# Altium project magic_baton.PrjPcb
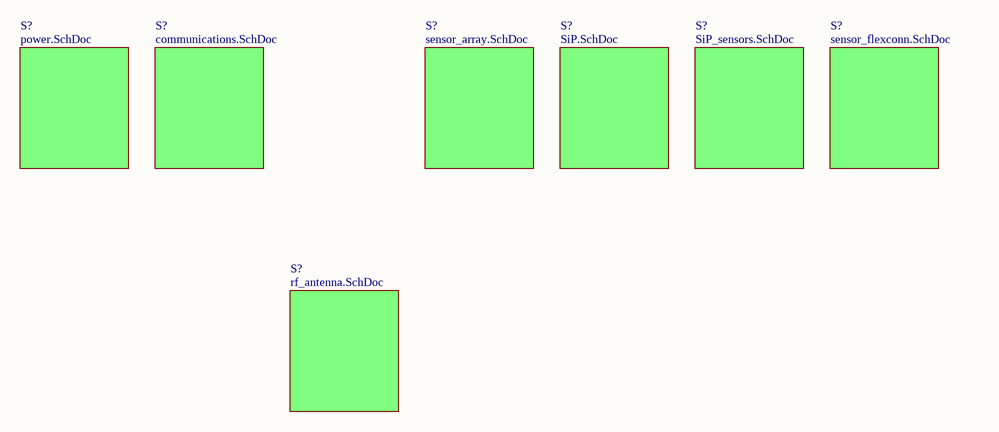
[diagram p0: magic_baton_top.SchDoc]
Revision: A
9 sheets, 174 parts. Net scope: hierarchical (ports join the sheet entries above them; power ports are global).
Sheets:
  magic_baton_top.SchDoc
    S? = power.SchDoc
    S? = communications.SchDoc
    S? = rf_antenna.SchDoc
    S? = sensor_array.SchDoc
      S1 = sensor_single.SchDoc
      S8 = sensor_single.SchDoc
      S7 = sensor_single.SchDoc
      S6 = sensor_single.SchDoc
      S5 = sensor_single.SchDoc
      S4 = sensor_single.SchDoc
      S3 = sensor_single.SchDoc
      S2 = sensor_single.SchDoc
      S9 = sensor_single.SchDoc
      S16 = sensor_single.SchDoc
      S15 = sensor_single.SchDoc
      S14 = sensor_single.SchDoc
      S13 = sensor_single.SchDoc
      S12 = sensor_single.SchDoc
      S11 = sensor_single.SchDoc
      S10 = sensor_single.SchDoc
      S17 = sensor_single.SchDoc
      S24 = sensor_single.SchDoc
      S23 = sensor_single.SchDoc
      S22 = sensor_single.SchDoc
      S21 = sensor_single.SchDoc
      S20 = sensor_single.SchDoc
      S19 = sensor_single.SchDoc
      S18 = sensor_single.SchDoc
      S25 = sensor_single.SchDoc
      S32 = sensor_single.SchDoc
      S31 = sensor_single.SchDoc
      S30 = sensor_single.SchDoc
      S29 = sensor_single.SchDoc
      S28 = sensor_single.SchDoc
      S27 = sensor_single.SchDoc
      S26 = sensor_single.SchDoc
    S? = SiP.SchDoc
    S? = SiP_sensors.SchDoc
    S? = sensor_flexconn.SchDoc

## Sheet magic_baton_top.SchDoc: Magic Baton: Top Sheet
size Letter; Organization: UBC ECE Capstone 2020S; Address1: Team 8; Address3: Magic Baton; Revision: A

### Sub-sheets
S? = power.SchDoc: no entries
S? = communications.SchDoc: no entries
S? = rf_antenna.SchDoc: no entries
S? = sensor_array.SchDoc: no entries
S? = SiP.SchDoc: no entries
S? = SiP_sensors.SchDoc: no entries
S? = sensor_flexconn.SchDoc: no entries

### Notes on the sheet
- Title
- Size:
- Date:
- Letter
- Number:
- Time:
- Revision:
- Sheet
- of
- File:

## Sheet power.SchDoc: Magic Baton: Power
size Letter
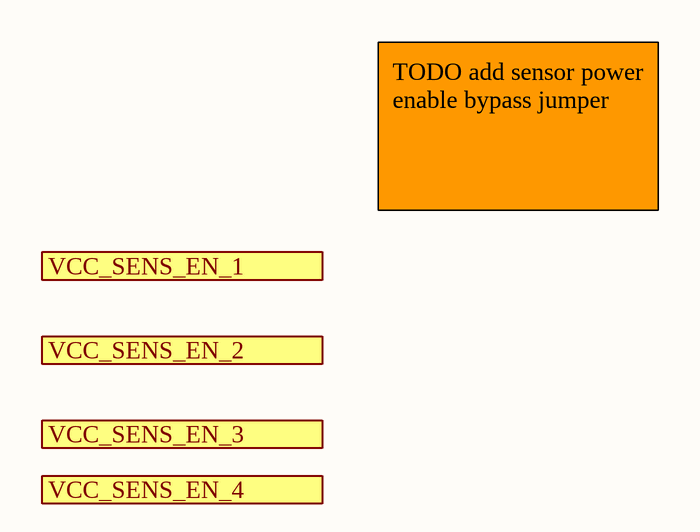
[diagram p1: power.SchDoc]

### Ports
VCC_SENS_EN_1 (in), VCC_SENS_EN_2 (in), VCC_SENS_EN_3 (in), VCC_SENS_EN_4 (in)

### Notes on the sheet
- TODO add sensor power enable bypass jumper
- Title
- Size:
- Date:
- Letter
- Number:
- Time:
- Revision:
- Sheet
- of
- File:

## Sheet communications.SchDoc: Magic Baton: Communications
size Letter

### Notes on the sheet
- Title
- Size:
- Date:
- Letter
- Number:
- Time:
- Revision:
- Sheet
- of
- File:

## Sheet rf_antenna.SchDoc: Magic Baton: RF
size Letter
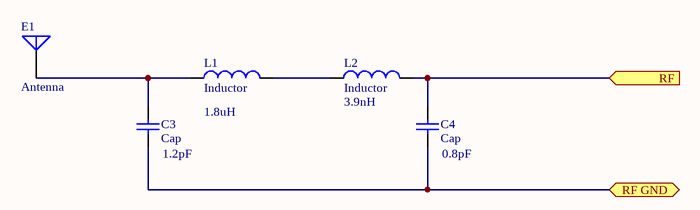
[diagram p2: rf_antenna.SchDoc]

### Parts
C3  Cap  value 1.2pF  [RAD-0.3]
C4  Cap  value 0.8pF  [RAD-0.3]
E1  Antenna  [PIN1]
L1  Inductor  value 1.8uH  [0402-A]
L2  Inductor  value 3.9nH  [0402-A]

### Ports
RF (in), RF GND (bidir)

### Nets
NetC3_1: C3.1 E1.1(A) L1.1
NetC3_2: C3.2 C4.2 ; port RF GND
NetC4_1: C4.1 L2.2 ; port RF
NetL1_2: L1.2 L2.1

### Notes on the sheet
- Title
- Size:
- Date:
- Letter
- Number:
- Time:
- Revision:
- Sheet
- of
- File:

### Library data of the parts
C3 C4 = Cap: Capacitor; Published: 8-Jun-2000; LatestRevisionDate: 17-Jul-2002; LatestRevisionNote: Re-released for DXP Platform.; PackageReference: RAD-0.3; Publisher: Altium Limited; PackageDescription: Radial Cap, Thru-Hole; 2 Leads; 0.3 in Pin Spacing
E1 = Antenna: Generic Antenna; Published: 24-Mar-1999; LatestRevisionDate: 17-Jul-2002; LatestRevisionNote: Re-released for DXP Platform.; PackageReference: PIN1; Publisher: Altium Limited
L1 L2 = Inductor: Code_IEC: 1005; Published: 8-Jun-2000; LatestRevisionDate: 29-May-2009; LatestRevisionNote: IPC-7351 Footprint Added.; PackageReference: 0402-A; Publisher: Altium Limited; PackageDescription: Chip Inductor; Code_JEITA: 0402

## Sheet sensor_array.SchDoc: Magic Baton: Sensor Array
size Letter
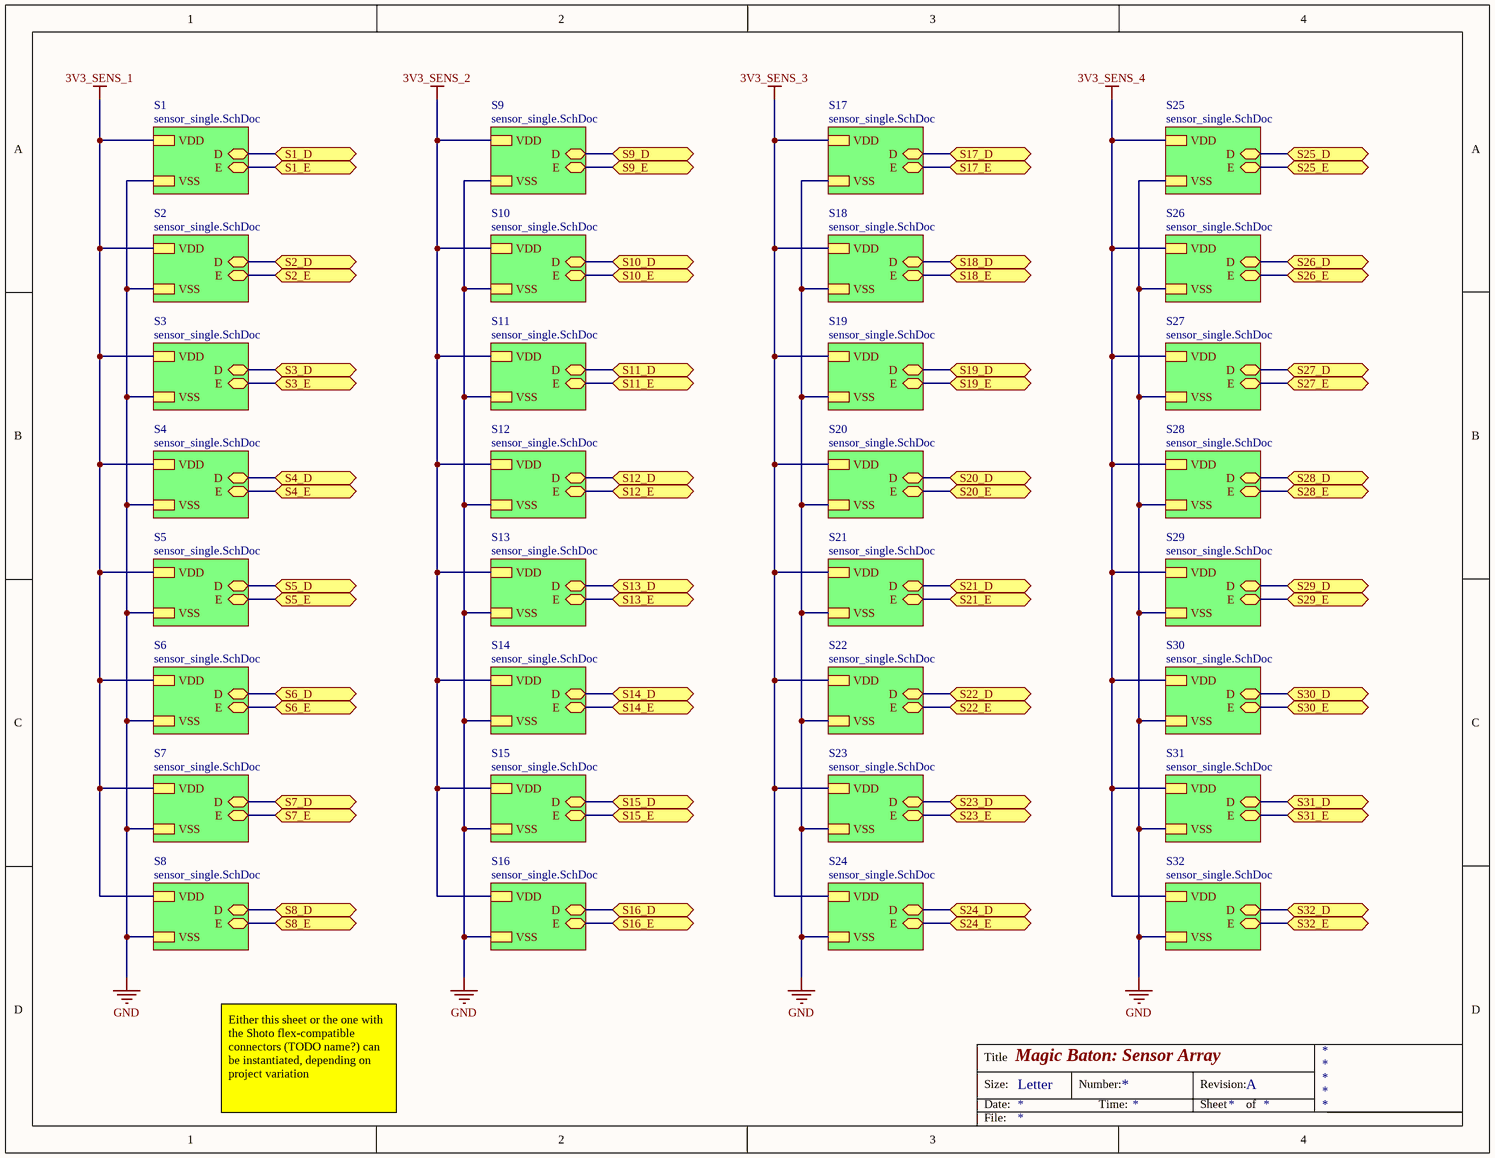
[diagram p3: sensor_array.SchDoc]

### Sub-sheets
S1 = sensor_single.SchDoc: D (bidir), E (bidir), VDD, VSS
S2 = sensor_single.SchDoc: D (bidir), E (bidir), VDD, VSS
S3 = sensor_single.SchDoc: D (bidir), E (bidir), VDD, VSS
S4 = sensor_single.SchDoc: D (bidir), E (bidir), VDD, VSS
S5 = sensor_single.SchDoc: D (bidir), E (bidir), VDD, VSS
S6 = sensor_single.SchDoc: D (bidir), E (bidir), VDD, VSS
S7 = sensor_single.SchDoc: D (bidir), E (bidir), VDD, VSS
S8 = sensor_single.SchDoc: D (bidir), E (bidir), VDD, VSS
S9 = sensor_single.SchDoc: D (bidir), E (bidir), VDD, VSS
S10 = sensor_single.SchDoc: D (bidir), E (bidir), VDD, VSS
S11 = sensor_single.SchDoc: D (bidir), E (bidir), VDD, VSS
S12 = sensor_single.SchDoc: D (bidir), E (bidir), VDD, VSS
S13 = sensor_single.SchDoc: D (bidir), E (bidir), VDD, VSS
S14 = sensor_single.SchDoc: D (bidir), E (bidir), VDD, VSS
S15 = sensor_single.SchDoc: D (bidir), E (bidir), VDD, VSS
S16 = sensor_single.SchDoc: D (bidir), E (bidir), VDD, VSS
S17 = sensor_single.SchDoc: D (bidir), E (bidir), VDD, VSS
S18 = sensor_single.SchDoc: D (bidir), E (bidir), VDD, VSS
S19 = sensor_single.SchDoc: D (bidir), E (bidir), VDD, VSS
S20 = sensor_single.SchDoc: D (bidir), E (bidir), VDD, VSS
S21 = sensor_single.SchDoc: D (bidir), E (bidir), VDD, VSS
S22 = sensor_single.SchDoc: D (bidir), E (bidir), VDD, VSS
S23 = sensor_single.SchDoc: D (bidir), E (bidir), VDD, VSS
S24 = sensor_single.SchDoc: D (bidir), E (bidir), VDD, VSS
S25 = sensor_single.SchDoc: D (bidir), E (bidir), VDD, VSS
S26 = sensor_single.SchDoc: D (bidir), E (bidir), VDD, VSS
S27 = sensor_single.SchDoc: D (bidir), E (bidir), VDD, VSS
S28 = sensor_single.SchDoc: D (bidir), E (bidir), VDD, VSS
S29 = sensor_single.SchDoc: D (bidir), E (bidir), VDD, VSS
S30 = sensor_single.SchDoc: D (bidir), E (bidir), VDD, VSS
S31 = sensor_single.SchDoc: D (bidir), E (bidir), VDD, VSS
S32 = sensor_single.SchDoc: D (bidir), E (bidir), VDD, VSS

### Ports
S1_D (bidir), S1_E (bidir), S2_D (bidir), S2_E (bidir), S3_D (bidir), S3_E (bidir), S4_D (bidir), S4_E (bidir), S5_D (bidir), S5_E (bidir), S6_D (bidir), S6_E (bidir), S7_D (bidir), S7_E (bidir), S8_D (bidir), S8_E (bidir), S9_D (bidir), S9_E (bidir), S10_D (bidir), S10_E (bidir), S11_D (bidir), S11_E (bidir), S12_D (bidir), S12_E (bidir), S13_D (bidir), S13_E (bidir), S14_D (bidir), S14_E (bidir), S15_D (bidir), S15_E (bidir), S16_D (bidir), S16_E (bidir), S17_D (bidir), S17_E (bidir), S18_D (bidir), S18_E (bidir), S19_D (bidir), S19_E (bidir), S20_D (bidir), S20_E (bidir), S21_D (bidir), S21_E (bidir), S22_D (bidir), S22_E (bidir), S23_D (bidir), S23_E (bidir), S24_D (bidir), S24_E (bidir), S25_D (bidir), S25_E (bidir), S26_D (bidir), S26_E (bidir), S27_D (bidir), S27_E (bidir), S28_D (bidir), S28_E (bidir), S29_D (bidir), S29_E (bidir), S30_D (bidir), S30_E (bidir), S31_D (bidir), S31_E (bidir), S32_D (bidir), S32_E (bidir)

### Nets
3V3_SENS_1: sheet S1/VDD, sheet S8/VDD, sheet S7/VDD, sheet S6/VDD, sheet S5/VDD, sheet S4/VDD, sheet S3/VDD, sheet S2/VDD
3V3_SENS_2: sheet S9/VDD, sheet S16/VDD, sheet S15/VDD, sheet S14/VDD, sheet S13/VDD, sheet S12/VDD, sheet S11/VDD, sheet S10/VDD
3V3_SENS_3: sheet S17/VDD, sheet S24/VDD, sheet S23/VDD, sheet S22/VDD, sheet S21/VDD, sheet S20/VDD, sheet S19/VDD, sheet S18/VDD
3V3_SENS_4: sheet S25/VDD, sheet S32/VDD, sheet S31/VDD, sheet S30/VDD, sheet S29/VDD, sheet S28/VDD, sheet S27/VDD, sheet S26/VDD
GND: sheet S1/VSS, sheet S8/VSS, sheet S7/VSS, sheet S6/VSS, sheet S5/VSS, sheet S4/VSS, sheet S3/VSS, sheet S2/VSS, sheet S9/VSS, sheet S16/VSS, sheet S15/VSS, sheet S14/VSS, sheet S13/VSS, sheet S12/VSS, sheet S11/VSS, sheet S10/VSS, sheet S17/VSS, sheet S24/VSS, sheet S23/VSS, sheet S22/VSS, sheet S21/VSS, sheet S20/VSS, sheet S19/VSS, sheet S18/VSS, sheet S25/VSS, sheet S32/VSS, sheet S31/VSS, sheet S30/VSS, sheet S29/VSS, sheet S28/VSS, sheet S27/VSS, sheet S26/VSS
NetU2_S1_C1: port S1_D, sheet S1/D
NetU2_S1_C2: port S1_E, sheet S1/E
NetU2_S2_C1: port S2_D, sheet S2/D
NetU2_S2_C2: port S2_E, sheet S2/E
NetU2_S3_C1: port S3_D, sheet S3/D
NetU2_S3_C2: port S3_E, sheet S3/E
NetU2_S4_C1: port S4_D, sheet S4/D
NetU2_S4_C2: port S4_E, sheet S4/E
NetU2_S5_C1: port S5_D, sheet S5/D
NetU2_S5_C2: port S5_E, sheet S5/E
NetU2_S6_C1: port S6_D, sheet S6/D
NetU2_S6_C2: port S6_E, sheet S6/E
NetU2_S7_C1: port S7_D, sheet S7/D
NetU2_S7_C2: port S7_E, sheet S7/E
NetU2_S8_C1: port S8_D, sheet S8/D
NetU2_S8_C2: port S8_E, sheet S8/E
NetU2_S9_C1: port S9_D, sheet S9/D
NetU2_S9_C2: port S9_E, sheet S9/E
NetU2_S10_C1: port S10_D, sheet S10/D
NetU2_S10_C2: port S10_E, sheet S10/E
NetU2_S11_C1: port S11_D, sheet S11/D
NetU2_S11_C2: port S11_E, sheet S11/E
NetU2_S12_C1: port S12_D, sheet S12/D
NetU2_S12_C2: port S12_E, sheet S12/E
NetU2_S13_C1: port S13_D, sheet S13/D
NetU2_S13_C2: port S13_E, sheet S13/E
NetU2_S14_C1: port S14_D, sheet S14/D
NetU2_S14_C2: port S14_E, sheet S14/E
NetU2_S15_C1: port S15_D, sheet S15/D
NetU2_S15_C2: port S15_E, sheet S15/E
NetU2_S16_C1: port S16_D, sheet S16/D
NetU2_S16_C2: port S16_E, sheet S16/E
NetU2_S17_C1: port S17_D, sheet S17/D
NetU2_S17_C2: port S17_E, sheet S17/E
NetU2_S18_C1: port S18_D, sheet S18/D
NetU2_S18_C2: port S18_E, sheet S18/E
NetU2_S19_C1: port S19_D, sheet S19/D
NetU2_S19_C2: port S19_E, sheet S19/E
NetU2_S20_C1: port S20_D, sheet S20/D
NetU2_S20_C2: port S20_E, sheet S20/E
NetU2_S21_C1: port S21_D, sheet S21/D
NetU2_S21_C2: port S21_E, sheet S21/E
NetU2_S22_C1: port S22_D, sheet S22/D
NetU2_S22_C2: port S22_E, sheet S22/E
NetU2_S23_C1: port S23_D, sheet S23/D
NetU2_S23_C2: port S23_E, sheet S23/E
NetU2_S24_C1: port S24_D, sheet S24/D
NetU2_S24_C2: port S24_E, sheet S24/E
NetU2_S25_C1: port S25_D, sheet S25/D
NetU2_S25_C2: port S25_E, sheet S25/E
NetU2_S26_C1: port S26_D, sheet S26/D
NetU2_S26_C2: port S26_E, sheet S26/E
NetU2_S27_C1: port S27_D, sheet S27/D
NetU2_S27_C2: port S27_E, sheet S27/E
NetU2_S28_C1: port S28_D, sheet S28/D
NetU2_S28_C2: port S28_E, sheet S28/E
NetU2_S29_C1: port S29_D, sheet S29/D
NetU2_S29_C2: port S29_E, sheet S29/E
NetU2_S30_C1: port S30_D, sheet S30/D
NetU2_S30_C2: port S30_E, sheet S30/E
NetU2_S31_C1: port S31_D, sheet S31/D
NetU2_S31_C2: port S31_E, sheet S31/E
NetU2_S32_C1: port S32_D, sheet S32/D
NetU2_S32_C2: port S32_E, sheet S32/E

### Notes on the sheet
- Either this sheet or the one with the Shoto flex-compatible connectors (TODO name?) can be instantiated, depending on project variation
- Title
- Size:
- Date:
- Letter
- Number:
- Time:
- Revision:
- Sheet
- of
- File:

## Sheet sensor_single.SchDoc: Magic Baton: Single Sensor
size Letter
Used 32 times, as channels S?/S1, S?/S8, S?/S7, S?/S6, S?/S5, S?/S4, S?/S3, S?/S2, S?/S9, S?/S16, S?/S15, S?/S14, S?/S13, S?/S12, S?/S11, S?/S10, S?/S17, S?/S24, S?/S23, S?/S22, S?/S21, S?/S20, S?/S19, S?/S18, S?/S25, S?/S32, S?/S31, S?/S30, S?/S29, S?/S28, S?/S27, S?/S26. Parts and nets are listed once, with the designators drawn on the sheet.
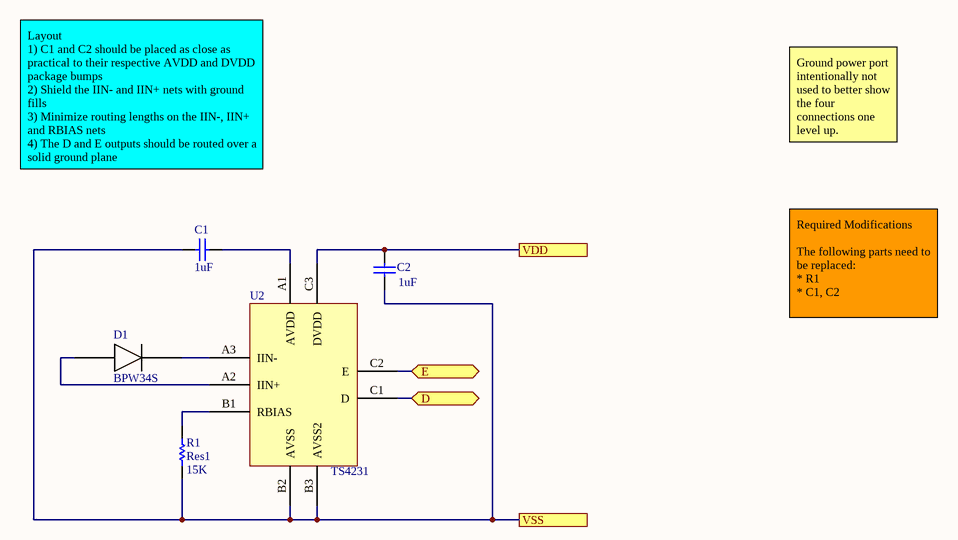
[diagram p4: sensor_single.SchDoc]

### Parts
C1  value 1uF  [RAD-0.3]  (hidden comment: Cap)
C2  value 1uF  [RAD-0.3]  (hidden comment: Cap)
D1  BPW34S
R1  Res1  value 15K  [AXIAL-0.3]
U2  TS4231

### Ports
D (bidir), E (bidir), VDD, VSS

### Nets
D: U2.C1(D) ; port D
E: U2.C2(E) ; port E
VDD: C2.1 U2.C3(DVDD) ; port VDD
VSS: C1.1 C2.2 R1.1 U2.B2(AVSS) U2.B3(AVSS2) ; port VSS
NetC1_2: C1.2 U2.A1(AVDD)
NetD1_A: D1.A U2.A2(IIN+)
NetD1_K: D1.K U2.A3(IIN-)
NetR1_2: R1.2 U2.B1(RBIAS)

### Channels
S?/S1: designators end in _S1; ports D=NetU2_S1_C1 E=NetU2_S1_C2 VDD=3V3_SENS_1 VSS=GND
S?/S8: designators end in _S8; ports D=NetU2_S8_C1 E=NetU2_S8_C2 VDD=3V3_SENS_1 VSS=GND
S?/S7: designators end in _S7; ports D=NetU2_S7_C1 E=NetU2_S7_C2 VDD=3V3_SENS_1 VSS=GND
S?/S6: designators end in _S6; ports D=NetU2_S6_C1 E=NetU2_S6_C2 VDD=3V3_SENS_1 VSS=GND
S?/S5: designators end in _S5; ports D=NetU2_S5_C1 E=NetU2_S5_C2 VDD=3V3_SENS_1 VSS=GND
S?/S4: designators end in _S4; ports D=NetU2_S4_C1 E=NetU2_S4_C2 VDD=3V3_SENS_1 VSS=GND
S?/S3: designators end in _S3; ports D=NetU2_S3_C1 E=NetU2_S3_C2 VDD=3V3_SENS_1 VSS=GND
S?/S2: designators end in _S2; ports D=NetU2_S2_C1 E=NetU2_S2_C2 VDD=3V3_SENS_1 VSS=GND
S?/S9: designators end in _S9; ports D=NetU2_S9_C1 E=NetU2_S9_C2 VDD=3V3_SENS_2 VSS=GND
S?/S16: designators end in _S16; ports D=NetU2_S16_C1 E=NetU2_S16_C2 VDD=3V3_SENS_2 VSS=GND
S?/S15: designators end in _S15; ports D=NetU2_S15_C1 E=NetU2_S15_C2 VDD=3V3_SENS_2 VSS=GND
S?/S14: designators end in _S14; ports D=NetU2_S14_C1 E=NetU2_S14_C2 VDD=3V3_SENS_2 VSS=GND
S?/S13: designators end in _S13; ports D=NetU2_S13_C1 E=NetU2_S13_C2 VDD=3V3_SENS_2 VSS=GND
S?/S12: designators end in _S12; ports D=NetU2_S12_C1 E=NetU2_S12_C2 VDD=3V3_SENS_2 VSS=GND
S?/S11: designators end in _S11; ports D=NetU2_S11_C1 E=NetU2_S11_C2 VDD=3V3_SENS_2 VSS=GND
S?/S10: designators end in _S10; ports D=NetU2_S10_C1 E=NetU2_S10_C2 VDD=3V3_SENS_2 VSS=GND
S?/S17: designators end in _S17; ports D=NetU2_S17_C1 E=NetU2_S17_C2 VDD=3V3_SENS_3 VSS=GND
S?/S24: designators end in _S24; ports D=NetU2_S24_C1 E=NetU2_S24_C2 VDD=3V3_SENS_3 VSS=GND
S?/S23: designators end in _S23; ports D=NetU2_S23_C1 E=NetU2_S23_C2 VDD=3V3_SENS_3 VSS=GND
S?/S22: designators end in _S22; ports D=NetU2_S22_C1 E=NetU2_S22_C2 VDD=3V3_SENS_3 VSS=GND
S?/S21: designators end in _S21; ports D=NetU2_S21_C1 E=NetU2_S21_C2 VDD=3V3_SENS_3 VSS=GND
S?/S20: designators end in _S20; ports D=NetU2_S20_C1 E=NetU2_S20_C2 VDD=3V3_SENS_3 VSS=GND
S?/S19: designators end in _S19; ports D=NetU2_S19_C1 E=NetU2_S19_C2 VDD=3V3_SENS_3 VSS=GND
S?/S18: designators end in _S18; ports D=NetU2_S18_C1 E=NetU2_S18_C2 VDD=3V3_SENS_3 VSS=GND
S?/S25: designators end in _S25; ports D=NetU2_S25_C1 E=NetU2_S25_C2 VDD=3V3_SENS_4 VSS=GND
S?/S32: designators end in _S32; ports D=NetU2_S32_C1 E=NetU2_S32_C2 VDD=3V3_SENS_4 VSS=GND
S?/S31: designators end in _S31; ports D=NetU2_S31_C1 E=NetU2_S31_C2 VDD=3V3_SENS_4 VSS=GND
S?/S30: designators end in _S30; ports D=NetU2_S30_C1 E=NetU2_S30_C2 VDD=3V3_SENS_4 VSS=GND
S?/S29: designators end in _S29; ports D=NetU2_S29_C1 E=NetU2_S29_C2 VDD=3V3_SENS_4 VSS=GND
S?/S28: designators end in _S28; ports D=NetU2_S28_C1 E=NetU2_S28_C2 VDD=3V3_SENS_4 VSS=GND
S?/S27: designators end in _S27; ports D=NetU2_S27_C1 E=NetU2_S27_C2 VDD=3V3_SENS_4 VSS=GND
S?/S26: designators end in _S26; ports D=NetU2_S26_C1 E=NetU2_S26_C2 VDD=3V3_SENS_4 VSS=GND

### Notes on the sheet
- Layout
  1) C1 and C2 should be placed as close as practical to their respective AVDD and DVDD package bumps
  2) Shield the IIN- and IIN+ nets with ground fills
  3) Minimize routing lengths on the IIN-, IIN+ and RBIAS nets
  4) The D and E outputs should be routed over a solid ground plane
- Ground power port intentionally not used to better show the four connections one level up.
- Required Modifications
  The following parts need to be replaced:
  * R1
  * C1, C2
- Title
- Size:
- Date:
- Letter
- Number:
- Time:
- Revision:
- Sheet
- of
- File:

### Library data of the parts
C1 C2 = Cap: Capacitor; Published: 8-Jun-2000; LatestRevisionDate: 17-Jul-2002; LatestRevisionNote: Re-released for DXP Platform.; PackageReference: RAD-0.3; Publisher: Altium Limited; PackageDescription: Radial Cap, Thru-Hole; 2 Leads; 0.3 in Pin Spacing
D1 = BPW34S: Silicon PIN Photodiode
R1 = Res1: Resistor; Published: 8-Jun-2000; LatestRevisionDate: 17-Jul-2002; LatestRevisionNote: Re-released for DXP Platform.; PackageReference: AXIAL-0.3; Publisher: Altium Limited; PackageDescription: Axial Device, Thru-Hole; 2 Leads; 0.3 in Pin Spacing
U2 = TS4231: Light to digital convertor for SteamVR 2.0 tracking.

## Sheet SiP.SchDoc: Magic Baton: SiP
size Letter
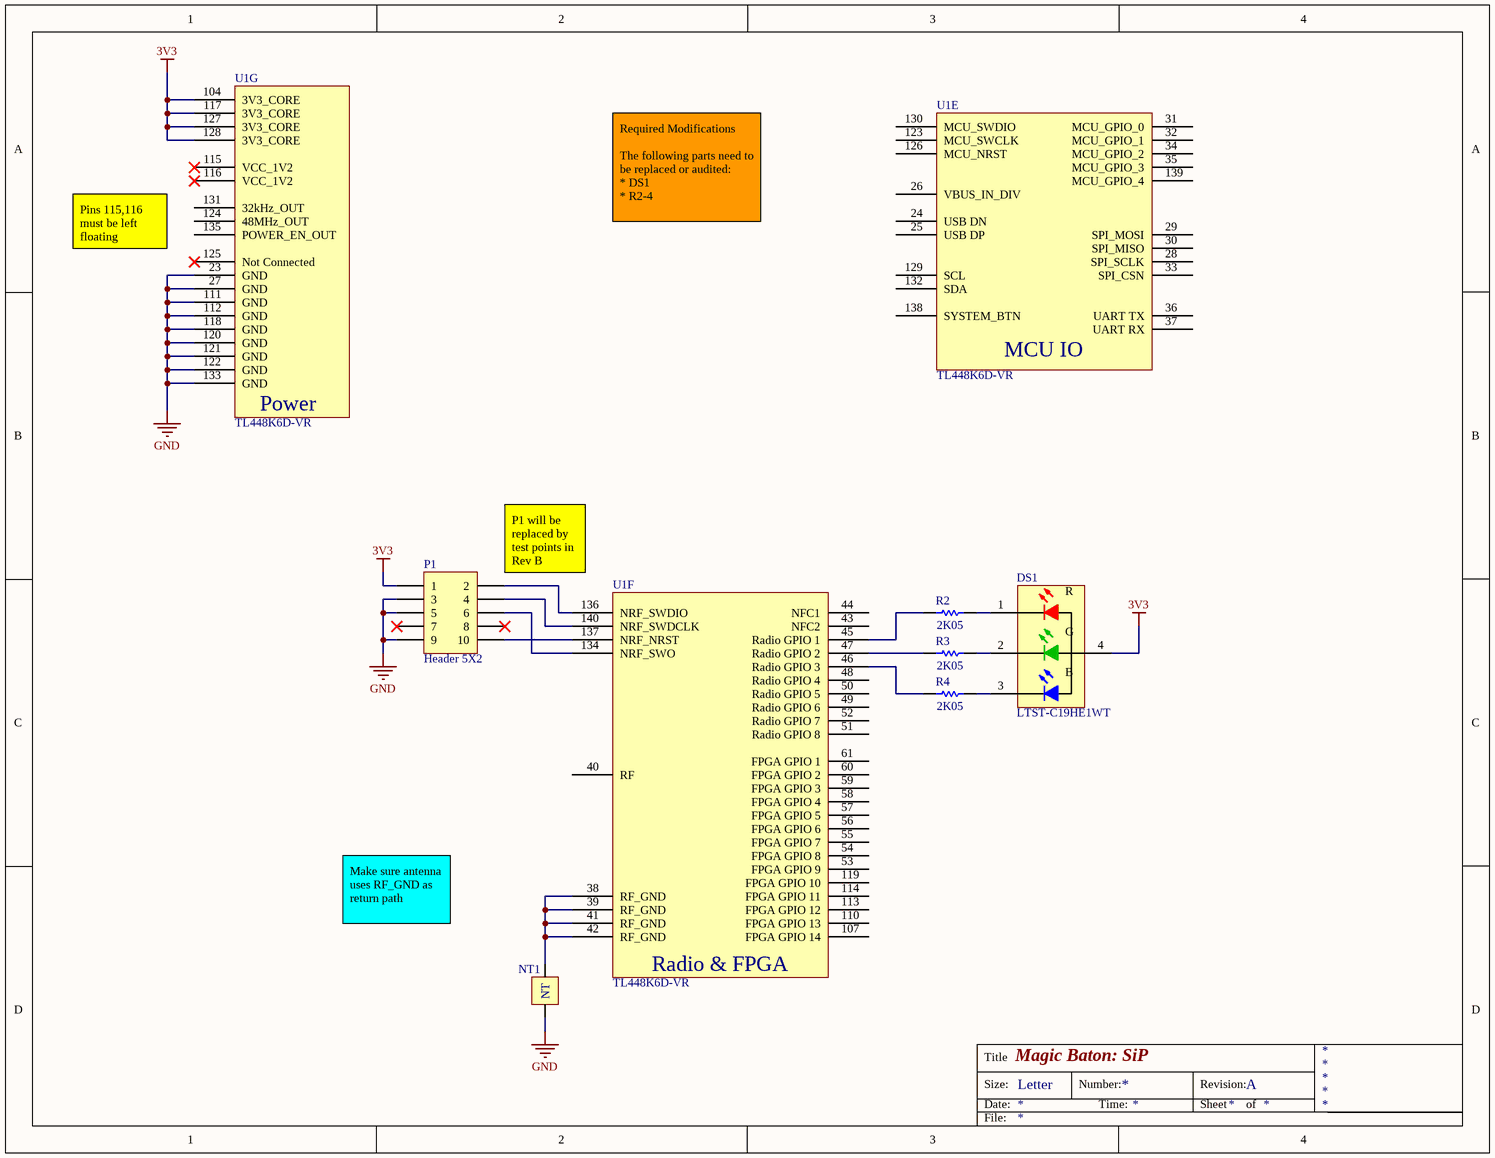
[diagram p5: SiP.SchDoc]

### Parts
DS1  LTST-C19HE1WT  [LTST-C19HE1WT-4_V]
NT1  NT1  (value not drawn)  (net tie, no BOM)
P1  Header 5X2  [HDR2X5]
R2  value 2K05  [AXIAL-0.3]  (hidden comment: Res1)
R3  value 2K05  [AXIAL-0.3]  (hidden comment: Res1)
R4  value 2K05  [AXIAL-0.3]  (hidden comment: Res1)
U1  TL448K6D-VR  [WatchmanModule_v4]  (parts E,F,G of 7)

### Nets
3V3: DS1.4(A) P1.1 U1.104(3V3_CORE) U1.117(3V3_CORE) U1.127(3V3_CORE) U1.128(3V3_CORE)
GND: NT1.1 P1.3 P1.5 P1.9 U1.23(GND) U1.27(GND) U1.111(GND) U1.112(GND) U1.118(GND) U1.120(GND) U1.121(GND) U1.122(GND) U1.133(GND)
NetDS1_1: DS1.1(R) R2.2
NetDS1_2: DS1.2(G) R3.2
NetDS1_3: DS1.3(B) R4.2
NetNT1_2: NT1.2 U1.38(RF_GND) U1.39(RF_GND) U1.41(RF_GND) U1.42(RF_GND)
NetP1_2: P1.2 U1.136(NRF_SWDIO)
NetP1_4: P1.4 U1.140(NRF_SWDCLK)
NetP1_6: P1.6 U1.134(NRF_SWO)
NetP1_10: P1.10 U1.137(NRF_NRST)
NetR2_1: R2.1 U1.45(Radio_GPIO_1)
NetR3_1: R3.1 U1.47(Radio_GPIO_2)
NetR4_1: R4.1 U1.46(Radio_GPIO_3)

Not connected (* = marked no-connect by the designer): P1 7* 8*; U1 24(USB_DN) 25(USB_DP) 26(VBUS_IN_DIV) 28(SPI_SCLK) 29(SPI_MOSI) 30(SPI_MISO) 31(MCU_GPIO_0) 32(MCU_GPIO_1) 33(SPI_CSN) 34(MCU_GPIO_2) 35(MCU_GPIO_3) 36(UART_TX) 37(UART_RX) 40(RF) 43(NFC2) 44(NFC1) 48(Radio_GPIO_4) 49(Radio_GPIO_6) 50(Radio_GPIO_5) 51(Radio_GPIO_8) 52(Radio_GPIO_7) 53(FPGA_GPIO_9) 54(FPGA_GPIO_8) 55(FPGA_GPIO_7) 56(FPGA_GPIO_6) 57(FPGA_GPIO_5) 58(FPGA_GPIO_4) 59(FPGA_GPIO_3) 60(FPGA_GPIO_2) 61(FPGA_GPIO_1) 107(FPGA_GPIO_14) 110(FPGA_GPIO_13) 113(FPGA_GPIO_12) 114(FPGA_GPIO_11) 115(VCC_1V2)* 116(VCC_1V2)* 119(FPGA_GPIO_10) 123(MCU_SWCLK) 124(48MHz_OUT) 125(Not_Connected)* 126(MCU_NRST) 129(SCL) 130(MCU_SWDIO) 131(32kHz_OUT) 132(SDA) 135(POWER_EN_OUT) 138(SYSTEM_BTN) 139(MCU_GPIO_4)

### Notes on the sheet
- Required Modifications
  The following parts need to be replaced or audited:
  * DS1
  * R2-4
- Pins 115,116 must be left floating
- P1 will be replaced by test points in Rev B
- Make sure antenna uses RF_GND as return path
- Title
- Size:
- Date:
- Letter
- Number:
- Time:
- Revision:
- Sheet
- of
- File:
- (in symbol NT1) NT
- (in symbol TL448K6D-VR, part E) MCU IO
- (in symbol TL448K6D-VR, part F) Radio & FPGA
- (in symbol TL448K6D-VR, part G) Power

### Library data of the parts
DS1 = CMP-2000-05201-1: LED Tri-Color Blue/Green/Red, 5 V, -20 to 80 degC, 4-Pin SMD, RoHS, Tape and Reel; Manufacturer: Lite-On; Viewing Angle: 130deg; Forward Voltage: 2.4(Red)V,3.9(Blue)V,3.9(Green)V; Lens Shape: Rectangle; LED Material: AlInGaP(Red),InGaN(Blue),InGaN(Green); Dominant Wavelength: 470/525/624nm; Luminous Intensity: 180mcd,450mcd; Number of LEDs: 3; LED Colours: Blue,Green,Red; Lens Colour: Clear; Number of Pins: 3; Series: LTST; Mounting Type: SurfaceMount; Datasheet URL: http://download.siliconexpert.com/pdfs/2014/3/25/6/41/6/148/lot_/manual/s_110_ltst-c19he1wt.pdf; Manufacturer URL: http://www.us.liteon.com/; Datasheet Version: Rev. B, 10/2013; Dimensions: 1.6x1.6x0.35mm
NT1 = NT1: Nettie
P1 = Header 5X2: Header, 5-Pin, Dual row; LatestRevisionDate: 17-Jul-2002; LatestRevisionNote: Re-released for DXP Platform.; Publisher: Altium Limited
R2-R4 = Res1: Resistor; Published: 8-Jun-2000; LatestRevisionDate: 17-Jul-2002; LatestRevisionNote: Re-released for DXP Platform.; PackageReference: AXIAL-0.3; Publisher: Altium Limited; PackageDescription: Axial Device, Thru-Hole; 2 Leads; 0.3 in Pin Spacing

## Sheet SiP_sensors.SchDoc: Magic Baton: SiP Sensor Connections
size Letter
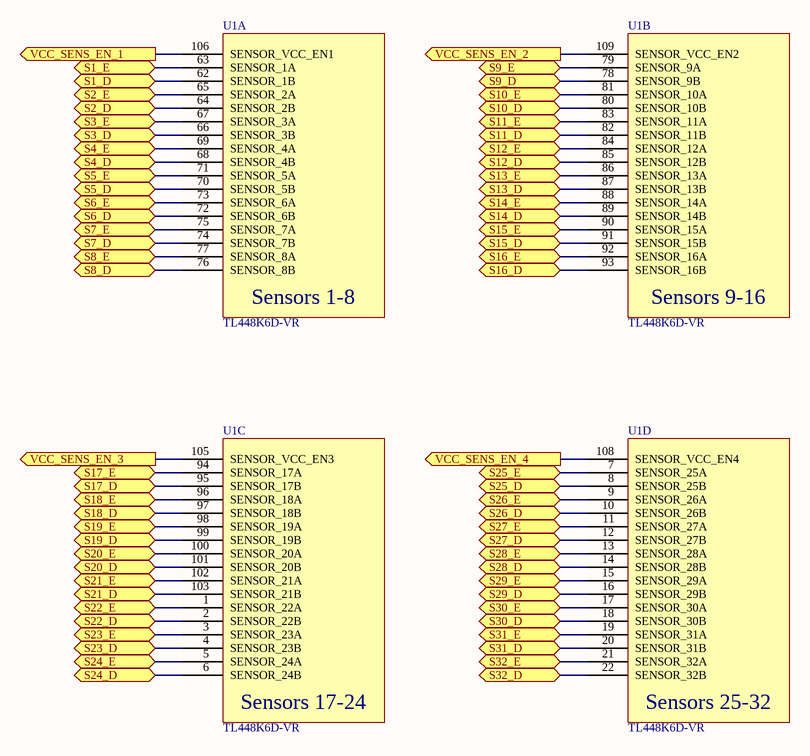
[diagram p6: SiP_sensors.SchDoc]

### Parts
U1  TL448K6D-VR  [WatchmanModule_v4]  (parts A,B,C,D of 7)

### Ports
S1_D (bidir), S1_E (bidir), S2_D (bidir), S2_E (bidir), S3_D (bidir), S3_E (bidir), S4_D (bidir), S4_E (bidir), S5_D (bidir), S5_E (bidir), S6_D (bidir), S6_E (bidir), S7_D (bidir), S7_E (bidir), S8_D (bidir), S8_E (bidir), S9_D (bidir), S9_E (bidir), S10_D (bidir), S10_E (bidir), S11_D (bidir), S11_E (bidir), S12_D (bidir), S12_E (bidir), S13_D (bidir), S13_E (bidir), S14_D (bidir), S14_E (bidir), S15_D (bidir), S15_E (bidir), S16_D (bidir), S16_E (bidir), S17_D (bidir), S17_E (bidir), S18_D (bidir), S18_E (bidir), S19_D (bidir), S19_E (bidir), S20_D (bidir), S20_E (bidir), S21_D (bidir), S21_E (bidir), S22_D (bidir), S22_E (bidir), S23_D (bidir), S23_E (bidir), S24_D (bidir), S24_E (bidir), S25_D (bidir), S25_E (bidir), S26_D (bidir), S26_E (bidir), S27_D (bidir), S27_E (bidir), S28_D (bidir), S28_E (bidir), S29_D (bidir), S29_E (bidir), S30_D (bidir), S30_E (bidir), S31_D (bidir), S31_E (bidir), S32_D (bidir), S32_E (bidir), VCC_SENS_EN_1 (out), VCC_SENS_EN_2 (out), VCC_SENS_EN_3 (out), VCC_SENS_EN_4 (out)

### Nets
NetU1_1: U1.1(SENSOR_22A) ; port S22_E
NetU1_2: U1.2(SENSOR_22B) ; port S22_D
NetU1_3: U1.3(SENSOR_23A) ; port S23_E
NetU1_4: U1.4(SENSOR_23B) ; port S23_D
NetU1_5: U1.5(SENSOR_24A) ; port S24_E
NetU1_6: U1.6(SENSOR_24B) ; port S24_D
NetU1_7: U1.7(SENSOR_25A) ; port S25_E
NetU1_8: U1.8(SENSOR_25B) ; port S25_D
NetU1_9: U1.9(SENSOR_26A) ; port S26_E
NetU1_10: U1.10(SENSOR_26B) ; port S26_D
NetU1_11: U1.11(SENSOR_27A) ; port S27_E
NetU1_12: U1.12(SENSOR_27B) ; port S27_D
NetU1_13: U1.13(SENSOR_28A) ; port S28_E
NetU1_14: U1.14(SENSOR_28B) ; port S28_D
NetU1_15: U1.15(SENSOR_29A) ; port S29_E
NetU1_16: U1.16(SENSOR_29B) ; port S29_D
NetU1_17: U1.17(SENSOR_30A) ; port S30_E
NetU1_18: U1.18(SENSOR_30B) ; port S30_D
NetU1_19: U1.19(SENSOR_31A) ; port S31_E
NetU1_20: U1.20(SENSOR_31B) ; port S31_D
NetU1_21: U1.21(SENSOR_32A) ; port S32_E
NetU1_22: U1.22(SENSOR_32B) ; port S32_D
NetU1_62: U1.62(SENSOR_1B) ; port S1_D
NetU1_63: U1.63(SENSOR_1A) ; port S1_E
NetU1_64: U1.64(SENSOR_2B) ; port S2_D
NetU1_65: U1.65(SENSOR_2A) ; port S2_E
NetU1_66: U1.66(SENSOR_3B) ; port S3_D
NetU1_67: U1.67(SENSOR_3A) ; port S3_E
NetU1_68: U1.68(SENSOR_4B) ; port S4_D
NetU1_69: U1.69(SENSOR_4A) ; port S4_E
NetU1_70: U1.70(SENSOR_5B) ; port S5_D
NetU1_71: U1.71(SENSOR_5A) ; port S5_E
NetU1_72: U1.72(SENSOR_6B) ; port S6_D
NetU1_73: U1.73(SENSOR_6A) ; port S6_E
NetU1_74: U1.74(SENSOR_7B) ; port S7_D
NetU1_75: U1.75(SENSOR_7A) ; port S7_E
NetU1_76: U1.76(SENSOR_8B) ; port S8_D
NetU1_77: U1.77(SENSOR_8A) ; port S8_E
NetU1_78: U1.78(SENSOR_9B) ; port S9_D
NetU1_79: U1.79(SENSOR_9A) ; port S9_E
NetU1_80: U1.80(SENSOR_10B) ; port S10_D
NetU1_81: U1.81(SENSOR_10A) ; port S10_E
NetU1_82: U1.82(SENSOR_11B) ; port S11_D
NetU1_83: U1.83(SENSOR_11A) ; port S11_E
NetU1_84: U1.84(SENSOR_12A) ; port S12_E
NetU1_85: U1.85(SENSOR_12B) ; port S12_D
NetU1_86: U1.86(SENSOR_13A) ; port S13_E
NetU1_87: U1.87(SENSOR_13B) ; port S13_D
NetU1_88: U1.88(SENSOR_14A) ; port S14_E
NetU1_89: U1.89(SENSOR_14B) ; port S14_D
NetU1_90: U1.90(SENSOR_15A) ; port S15_E
NetU1_91: U1.91(SENSOR_15B) ; port S15_D
NetU1_92: U1.92(SENSOR_16A) ; port S16_E
NetU1_93: U1.93(SENSOR_16B) ; port S16_D
NetU1_94: U1.94(SENSOR_17A) ; port S17_E
NetU1_95: U1.95(SENSOR_17B) ; port S17_D
NetU1_96: U1.96(SENSOR_18A) ; port S18_E
NetU1_97: U1.97(SENSOR_18B) ; port S18_D
NetU1_98: U1.98(SENSOR_19A) ; port S19_E
NetU1_99: U1.99(SENSOR_19B) ; port S19_D
NetU1_100: U1.100(SENSOR_20A) ; port S20_E
NetU1_101: U1.101(SENSOR_20B) ; port S20_D
NetU1_102: U1.102(SENSOR_21A) ; port S21_E
NetU1_103: U1.103(SENSOR_21B) ; port S21_D
NetU1_105: U1.105(SENSOR_VCC_EN3) ; port VCC_SENS_EN_3
NetU1_106: U1.106(SENSOR_VCC_EN1) ; port VCC_SENS_EN_1
NetU1_108: U1.108(SENSOR_VCC_EN4) ; port VCC_SENS_EN_4
NetU1_109: U1.109(SENSOR_VCC_EN2) ; port VCC_SENS_EN_2

### Notes on the sheet
- Title
- Size:
- Date:
- Letter
- Number:
- Time:
- Revision:
- Sheet
- of
- File:
- (in symbol TL448K6D-VR, part A) Sensors 1-8
- (in symbol TL448K6D-VR, part B) Sensors 9-16
- (in symbol TL448K6D-VR, part C) Sensors 17-24
- (in symbol TL448K6D-VR, part D) Sensors 25-32

## Sheet sensor_flexconn.SchDoc: Magic Baton: Sensor Flex Connector
size Letter
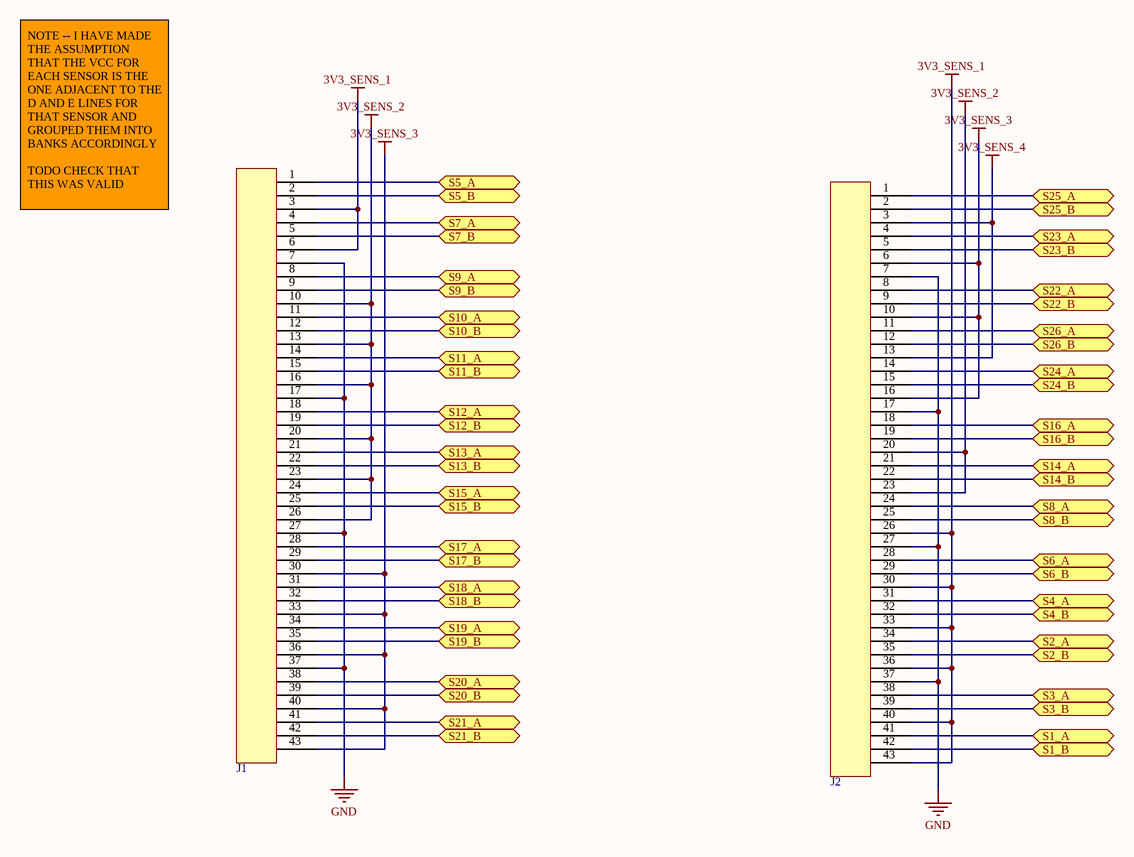
[diagram p7: sensor_flexconn.SchDoc]

### Parts
J1  503566-4302  (value not drawn)
J2  503566-4302  (value not drawn)

### Ports
S1_A (bidir), S1_B (bidir), S2_A (bidir), S2_B (bidir), S3_A (bidir), S3_B (bidir), S4_A (bidir), S4_B (bidir), S5_A (bidir), S5_B (bidir), S6_A (bidir), S6_B (bidir), S7_A (bidir), S7_B (bidir), S8_A (bidir), S8_B (bidir), S9_A (bidir), S9_B (bidir), S10_A (bidir), S10_B (bidir), S11_A (bidir), S11_B (bidir), S12_A (bidir), S12_B (bidir), S13_A (bidir), S13_B (bidir), S14_A (bidir), S14_B (bidir), S15_A (bidir), S15_B (bidir), S16_A (bidir), S16_B (bidir), S17_A (bidir), S17_B (bidir), S18_A (bidir), S18_B (bidir), S19_A (bidir), S19_B (bidir), S20_A (bidir), S20_B (bidir), S21_A (bidir), S21_B (bidir), S22_A (bidir), S22_B (bidir), S23_A (bidir), S23_B (bidir), S24_A (bidir), S24_B (bidir), S25_A (bidir), S25_B (bidir), S26_A (bidir), S26_B (bidir)

### Nets
3V3_SENS_1: J1.3 J1.6 J2.26 J2.30 J2.33 J2.36 J2.40 J2.43
3V3_SENS_2: J1.10 J1.13 J1.16 J1.20 J1.23 J1.26 J2.20 J2.23
3V3_SENS_3: J1.30 J1.33 J1.36 J1.40 J1.43 J2.6 J2.10 J2.16
3V3_SENS_4: J2.3 J2.13
GND: J1.7 J1.17 J1.27 J1.37 J2.7 J2.17 J2.27 J2.37
NetJ1_1: J1.1 ; port S5_A
NetJ1_2: J1.2 ; port S5_B
NetJ1_4: J1.4 ; port S7_A
NetJ1_5: J1.5 ; port S7_B
NetJ1_8: J1.8 ; port S9_A
NetJ1_9: J1.9 ; port S9_B
NetJ1_11: J1.11 ; port S10_A
NetJ1_12: J1.12 ; port S10_B
NetJ1_14: J1.14 ; port S11_A
NetJ1_15: J1.15 ; port S11_B
NetJ1_18: J1.18 ; port S12_A
NetJ1_19: J1.19 ; port S12_B
NetJ1_21: J1.21 ; port S13_A
NetJ1_22: J1.22 ; port S13_B
NetJ1_24: J1.24 ; port S15_A
NetJ1_25: J1.25 ; port S15_B
NetJ1_28: J1.28 ; port S17_A
NetJ1_29: J1.29 ; port S17_B
NetJ1_31: J1.31 ; port S18_A
NetJ1_32: J1.32 ; port S18_B
NetJ1_34: J1.34 ; port S19_A
NetJ1_35: J1.35 ; port S19_B
NetJ1_38: J1.38 ; port S20_A
NetJ1_39: J1.39 ; port S20_B
NetJ1_41: J1.41 ; port S21_A
NetJ1_42: J1.42 ; port S21_B
NetJ2_1: J2.1 ; port S25_A
NetJ2_2: J2.2 ; port S25_B
NetJ2_4: J2.4 ; port S23_A
NetJ2_5: J2.5 ; port S23_B
NetJ2_8: J2.8 ; port S22_A
NetJ2_9: J2.9 ; port S22_B
NetJ2_11: J2.11 ; port S26_A
NetJ2_12: J2.12 ; port S26_B
NetJ2_14: J2.14 ; port S24_A
NetJ2_15: J2.15 ; port S24_B
NetJ2_18: J2.18 ; port S16_A
NetJ2_19: J2.19 ; port S16_B
NetJ2_21: J2.21 ; port S14_A
NetJ2_22: J2.22 ; port S14_B
NetJ2_24: J2.24 ; port S8_A
NetJ2_25: J2.25 ; port S8_B
NetJ2_28: J2.28 ; port S6_A
NetJ2_29: J2.29 ; port S6_B
NetJ2_31: J2.31 ; port S4_A
NetJ2_32: J2.32 ; port S4_B
NetJ2_34: J2.34 ; port S2_A
NetJ2_35: J2.35 ; port S2_B
NetJ2_38: J2.38 ; port S3_A
NetJ2_39: J2.39 ; port S3_B
NetJ2_41: J2.41 ; port S1_A
NetJ2_42: J2.42 ; port S1_B

### Notes on the sheet
- NOTE -- I HAVE MADE THE ASSUMPTION THAT THE VCC FOR EACH SENSOR IS THE ONE ADJACENT TO THE D AND E LINES FOR THAT SENSOR AND GROUPED THEM INTO BANKS ACCORDINGLY
  TODO CHECK THAT THIS WAS VALID
- Title
- Size:
- Date:
- Letter
- Number:
- Time:
- Revision:
- Sheet
- of
- File:

### Library data of the parts
J1 J2 = 503566-4302: FPC Connector, 43P, 0.3mm

## Nets that join several sheets
3V3_SENS_1: S?/S1 (C2_S1.1 U2_S1.C3), S?/S8 (C2_S8.1 U2_S8.C3), S?/S7 (C2_S7.1 U2_S7.C3), S?/S6 (C2_S6.1 U2_S6.C3), S?/S5 (C2_S5.1 U2_S5.C3), S?/S4 (C2_S4.1 U2_S4.C3), S?/S3 (C2_S3.1 U2_S3.C3), S?/S2 (C2_S2.1 U2_S2.C3), sensor_flexconn (8 pins)
3V3_SENS_2: S?/S9 (C2_S9.1 U2_S9.C3), S?/S16 (C2_S16.1 U2_S16.C3), S?/S15 (C2_S15.1 U2_S15.C3), S?/S14 (C2_S14.1 U2_S14.C3), S?/S13 (C2_S13.1 U2_S13.C3), S?/S12 (C2_S12.1 U2_S12.C3), S?/S11 (C2_S11.1 U2_S11.C3), S?/S10 (C2_S10.1 U2_S10.C3), sensor_flexconn (8 pins)
3V3_SENS_3: S?/S17 (C2_S17.1 U2_S17.C3), S?/S24 (C2_S24.1 U2_S24.C3), S?/S23 (C2_S23.1 U2_S23.C3), S?/S22 (C2_S22.1 U2_S22.C3), S?/S21 (C2_S21.1 U2_S21.C3), S?/S20 (C2_S20.1 U2_S20.C3), S?/S19 (C2_S19.1 U2_S19.C3), S?/S18 (C2_S18.1 U2_S18.C3), sensor_flexconn (8 pins)
3V3_SENS_4: S?/S25 (C2_S25.1 U2_S25.C3), S?/S32 (C2_S32.1 U2_S32.C3), S?/S31 (C2_S31.1 U2_S31.C3), S?/S30 (C2_S30.1 U2_S30.C3), S?/S29 (C2_S29.1 U2_S29.C3), S?/S28 (C2_S28.1 U2_S28.C3), S?/S27 (C2_S27.1 U2_S27.C3), S?/S26 (C2_S26.1 U2_S26.C3), sensor_flexconn (J2.3 J2.13)
GND: S?/S1 (5 pins), S?/S8 (5 pins), S?/S7 (5 pins), S?/S6 (5 pins), S?/S5 (5 pins), S?/S4 (5 pins), S?/S3 (5 pins), S?/S2 (5 pins), S?/S9 (5 pins), S?/S16 (5 pins), S?/S15 (5 pins), S?/S14 (5 pins), S?/S13 (5 pins), S?/S12 (5 pins), S?/S11 (5 pins), S?/S10 (5 pins), S?/S17 (5 pins), S?/S24 (5 pins), S?/S23 (5 pins), S?/S22 (5 pins), S?/S21 (5 pins), S?/S20 (5 pins), S?/S19 (5 pins), S?/S18 (5 pins), S?/S25 (5 pins), S?/S32 (5 pins), S?/S31 (5 pins), S?/S30 (5 pins), S?/S29 (5 pins), S?/S28 (5 pins), S?/S27 (5 pins), S?/S26 (5 pins), SiP (13 pins), sensor_flexconn (8 pins)

## Assembly variants
Standard: not fitted P1